# EAGLE schematic Odbiornik_2 (EAGLE 9.0.1)
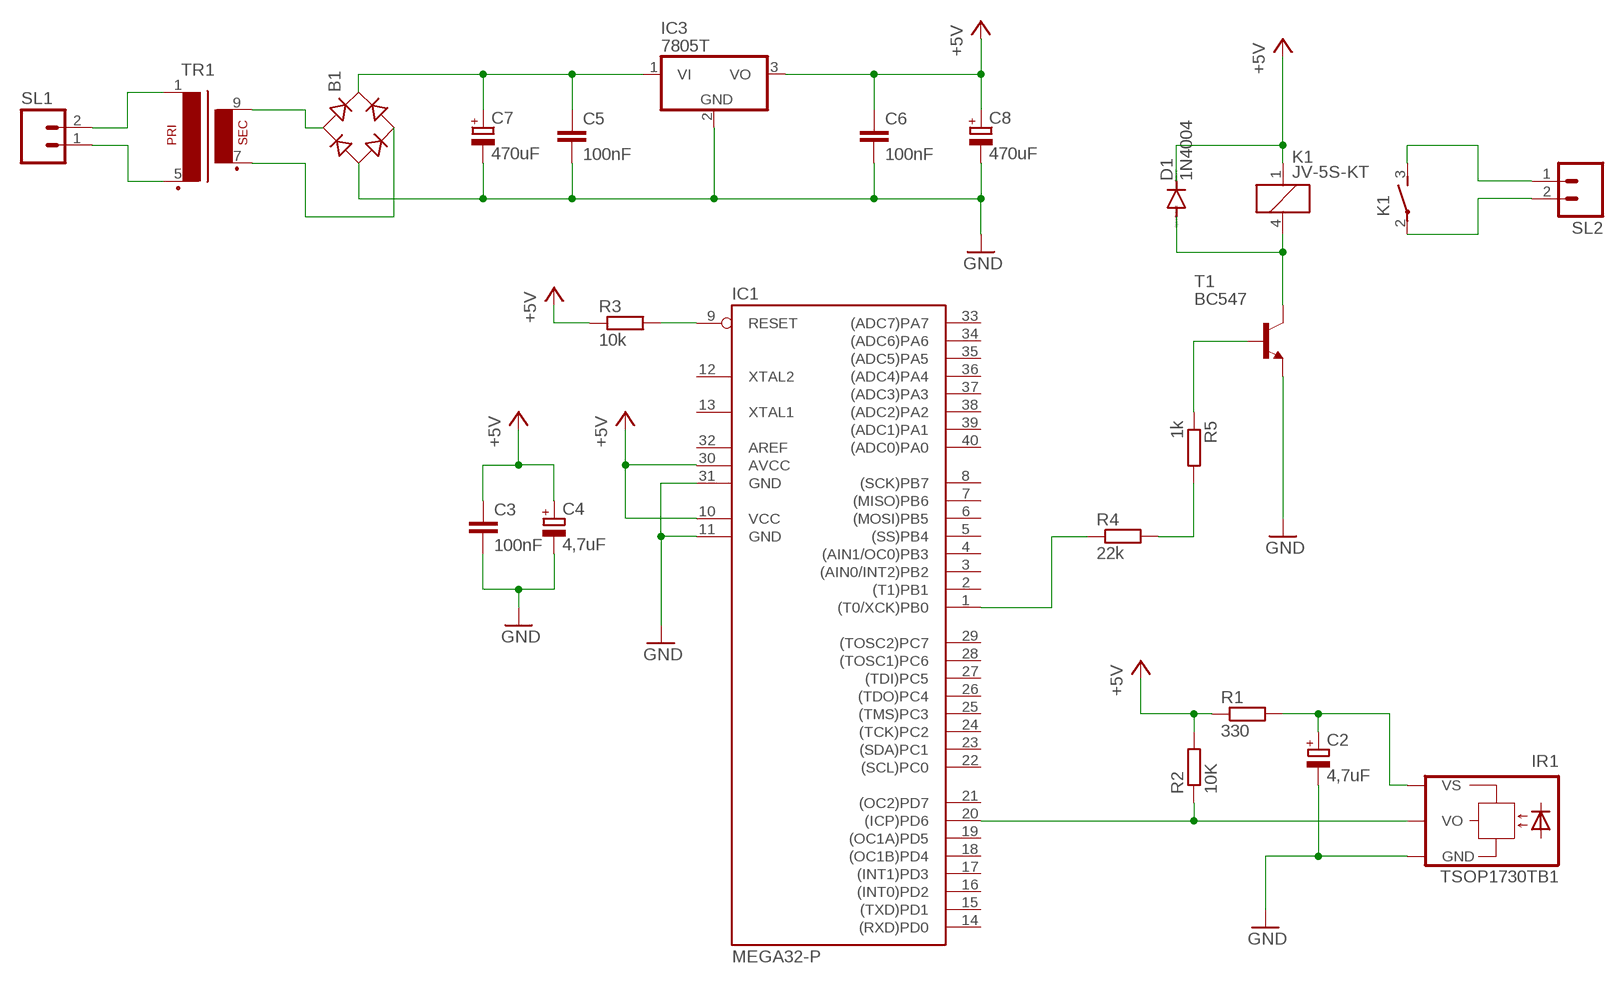
[diagram p0: schematic, sheet 1]

## Parts
B1  RB1A  [RB1A]
C2  4,7uF  CPOL-EUE2-4  [E2-4]
C3  100nF  C-EU025-024X044  [C025-024X044]
C4  4,7uF  CPOL-EUE2-4  [E2-4]
C5  100nF  C-EU025-024X044  [C025-024X044]
C6  100nF  C-EU025-024X044  [C025-024X044]
C7  470uF  CPOL-EUE2-4  [E2-4]
C8  470uF  CPOL-EUE2-4  [E2-4]
D1  1N4004  [DO41-10]
IC1  MEGA32-P  [DIL40]
IC3  7805T  [TO220H]
IR1  TSOP1730TB1  [TSOP17_TB1]
K1  JV-5S-KT  [JV-KT]
R1  330  R-EU_0204/5  [0204/5]
R2  10K  R-EU_0204/5  [0204/5]
R3  10k  R-EU_0204/5  [0204/5]
R4  22k  R-EU_0204/5  [0204/5]
R5  1k  R-EU_0204/5  [0204/5]
SL1  M02  [02P]
SL2  M02  [02P]
T1  BC547  [TO92]
TR1  EI42-1  [EI42-1]

## Nets
+5V: C3.1 C4.+ C6.1 C8.+ D1.C IC1.10(VCC) IC1.30(AVCC) IC3.3(VO) K1.1 R1.1 R2.2 R3.1
GND: B1.- C2.- C3.2 C4.- C5.2 C6.2 C7.- C8.- IC1.11(GND) IC1.31(GND) IC3.2(GND) IR1.GND T1.1(E)
N$1: IC1.20((ICP)PD6) IR1.VO R2.1
N$2: C2.+ IR1.VS R1.2
N$3: IC1.9(RESET) R3.2
N$4: IC1.1((T0/XCK)PB0) R4.1
N$5: R4.2 R5.2
N$6: R5.1 T1.2(B)
N$7: D1.A K1.4 T1.3(C)
N$8: B1.+ C5.1 C7.+ IC3.1(VI)
N$9: B1.AC2 TR1.7(S3)
N$10: SL1.2 TR1.1
N$11: SL1.1 TR1.5(P2)
N$12: K1.2(P) SL2.2
N$13: K1.3(S) SL2.1
N$15: B1.AC1 TR1.9(S4)
Unconnected: IC1.2((T1)PB1) IC1.3((AIN0/INT2)PB2) IC1.4((AIN1/OC0)PB3) IC1.5((SS)PB4) IC1.6((MOSI)PB5) IC1.7((MISO)PB6) IC1.8((SCK)PB7) IC1.12(XTAL2) IC1.13(XTAL1) IC1.14((RXD)PD0) IC1.15((TXD)PD1) IC1.16((INT0)PD2) IC1.17((INT1)PD3) IC1.18((OC1B)PD4) IC1.19((OC1A)PD5) IC1.21((OC2)PD7) IC1.22((SCL)PC0) IC1.23((SDA)PC1) IC1.24((TCK)PC2) IC1.25((TMS)PC3) IC1.26((TDO)PC4) IC1.27((TDI)PC5) IC1.28((TOSC1)PC6) IC1.29((TOSC2)PC7) IC1.32(AREF) IC1.33((ADC7)PA7) IC1.34((ADC6)PA6) IC1.35((ADC5)PA5) IC1.36((ADC4)PA4) IC1.37((ADC3)PA3) IC1.38((ADC2)PA2) IC1.39((ADC1)PA1) IC1.40((ADC0)PA0)

## Library data of the parts
B1 = rectifier:RB1A: RECTIFIER 1 A
C2 C4 C7 C8 = resistor:CPOL-EU: POLARIZED CAPACITOR, European symbol
C3 C5 C6 = resistor:C-EU: CAPACITOR, European symbol
D1 = diode:1N4004: DIODE general purpose rectifier, 1 A
IC1 = atmel:MEGA32-P: MICROCONTROLLER 32 Kbytes FLASH 2 Kbytes SRAM 1 Kbytes EEPROM USART 8-channel 10 bit ADC Source: www.atmel.com .. doc2503.pdf; MPN: ATMEGA32-16PU; OC_FARNELL: 1661729; OC_NEWARK: 51P1794
IC3 = linear:78*: Positive VOLTAGE REGULATOR Source: http://cache.national.com/ds/LM/LM78L05.pdf http://www.fairchildsemi.com/ds/LM/LM7805.pdf
IR1 = telefunken:TSOP17*TB1: TSOP17..TB1 IR Receiver Modules for Remote Control Systems Source: http://www.vishay.com/docs/82042/82042.pdf; OC_FARNELL: unknown; OC_NEWARK: unknown
K1 = relay:JV*-KT: POWER RELAY JV SERIES 1 POLE—5 A (MEDIUM LOAD CONTROL) Source: Data sheet <http://www.produktinfo.conrad.com/datenblaetter/500000-524999/502946-da-01-en-RELAIS_JV_12S_KT.pdf>
R1-R5 = resistor:R-EU_: RESISTOR, European symbol
SL1 SL2 = con-amp-quick:M02: AMP QUICK CONNECTOR; OC_FARNELL: unknown; OC_NEWARK: unknown
T1 = transistor:BC547: NPN TRANSISTOR
TR1 = trafo:EI42-1: TRANSFORMER 1 primary winding, 1 secondary winding ERA